# Altium schematic sheet POWER.SchDoc: POWER
size A4; Date: *******; ApprovedBy: *******; Author: *******; CompanyName: *******; Engineer: *******; Organization: *******; Address1: *******; Address2: *******; Address3: *******; Address4: *******; DocumentNumber: 2; Revision: *******; SheetNumber: 2; SheetTotal: 4; CurrentTime: *******; CurrentDate: *******; Time: *******; DocumentFullPathAndName: *******; DocumentName: *******; ModifiedDate: *******; ImagePath: *******; ProjectName: *******; Application_BuildNumber: *******
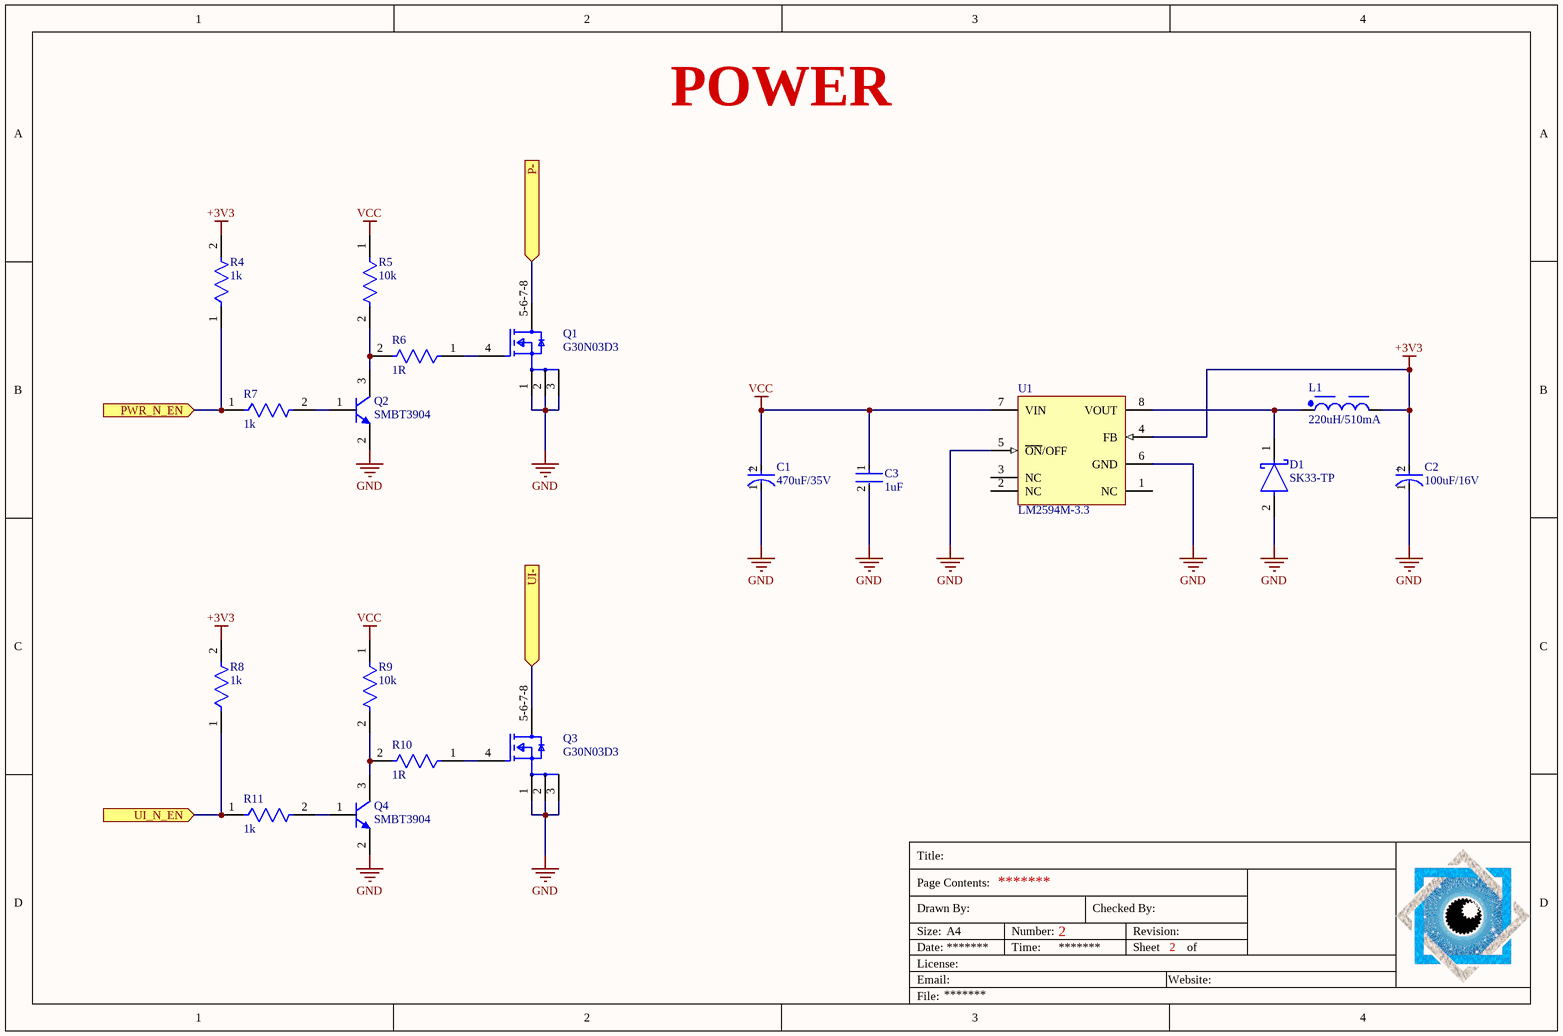
[diagram p0: POWER.SchDoc]

## Parts
C1  470uF/35V  [FP-FKSG-MFG]
C2  100uF/16V  [FP-TAJC-MFG]
C3  1uF  [FP-0603-L_1_6_0_15-W_0_8-IPC_C]
D1  SK33-TP  [FP-SMC-MFG]
L1  220uH/510mA  [WE-PD2_7850]
Q1  G30N03D3  [FP-511AB-MFG]
Q2  SMBT3904  [INF-SOT23_L]
Q3  G30N03D3  [FP-511AB-MFG]
Q4  SMBT3904  [INF-SOT23_L]
R4  1k  [FP-RP731J-MFG]
R5  10k  [FP-RP731J-MFG]
R6  1R  [FP-RP731J-MFG]
R7  1k  [FP-RP731J-MFG]
R8  1k  [FP-RP731J-MFG]
R9  10k  [FP-RP731J-MFG]
R10  1R  [FP-RP731J-MFG]
R11  1k  [FP-RP731J-MFG]
U1  LM2594M-3.3  [D0008A_M]

## Ports
P- (in, see CONNECTORS[1B]), PWR_N_EN (in, see MCU[2C]), UI- (in, see CONNECTORS[1B]), UI_N_EN (in, see MCU[2B])

## Nets
+3V3: C2.2(A) L1.2 R4.2 R8.2 U1.4(FB)
GND: C1.1(C) C2.1(C) C3.2 D1.2(A) Q1.1(S) Q1.2(S) Q1.3(S) Q2.2(E) Q3.1(S) Q3.2(S) Q3.3(S) Q4.2(E) U1.5(~{ON}/OFF) U1.6(GND)
VCC: C1.2(A) C3.1 R5.1 R9.1 U1.7(VIN)
P-: Q1.5-6-7-8(D) ; port P-
PWR_N_EN: R4.1 R7.1 ; port PWR_N_EN
UI-: Q3.5-6-7-8(D) ; port UI-
UI_N_EN: R8.1 R11.1 ; port UI_N_EN
NetD1_1: D1.1(C) L1.1 U1.8(VOUT)
NetQ1_4: Q1.4(G) R6.1
NetQ2_1: Q2.1(B) R7.2
NetQ2_3: Q2.3(C) R5.2 R6.2
NetQ3_4: Q3.4(G) R10.1
NetQ4_1: Q4.1(B) R11.2
NetQ4_3: Q4.3(C) R9.2 R10.2

Not connected (* = marked no-connect by the designer): U1 1(NC) 2(NC) 3(NC)

## Notes on the sheet
- Title:
- Drawn By:
- Page Contents:
- Checked By:
- Size:
- Date:
- File:
- License:
- Email:
- A4
- Number:
- Time:
- Revision:
- Sheet
- Website:
- of
- (in symbol CMP-2100-03691-2) +
- (in symbol CMP-05427-000037-1) +

## Library data of the parts
C1 = CMP-05427-000037-1: CAP ALUM 470UF 20% 35V SMD; Ripple Current: 552.5mA; Life (Hours): 2000Hour; ESR (Equivalent Series Resistance): 80mR; Ripple Current (AC): 850mA; Polarity: Polar; Max Operating Temperature: 105°C; Height - Seated (Max): 0.413inch; Height: 10.2mm; Min Operating Temperature: -55°C; Voltage Rating: 35V; Voltage Rating (DC): 35V; Package Quantity: 500; Packaging: Cut Tape; Tolerance: 20%; Capacitance: 470uF; RoHS Compliant: Yes; Mount: Surface Mount; Case/Package: Radial; Diameter: 10mm; LCSC Part #: C280413
C2 = CMP-2100-03691-2: 100uF 16V  ±10% 1Ω 2312  SMD Tantalum Capacitor; Polarity: Polar; Dissipation Factor: 8%; Leakage Current: 16uA; ESR (Equivalent Series Resistance): 1R; Width: 3.2mm; Case Code (Metric): 6032; Length: 6mm; Case Code (Imperial): 2412; Height: 2.8mm; Series: TAJ; Capacitance: 100uF; Package Quantity: 1; Height - Seated (Max): 0.11inch; Depth: 3.2mm; RoHS Compliant: Yes; Min Operating Temperature: -55°C; Mount: Surface Mount; Termination: SMD/SMT; Packaging: Tape and Reel; Max Operating Temperature: 125°C; Voltage Rating (DC): 16V; Construction: Flat; Radiation Hardening: No; Number of Pins: 2; Lead Free: Lead Free; Tolerance: 10%; Voltage Rating: 16V; Features: General Purpose; REACH SVHC: No SVHC; Case/Package: Molded; LCSC Part #: C122646
C3 = CMP-2000-07531-4: Ceramic Capacitor General Use 1uF ±10% 50V X7R 0603; Series: M; Width: 0.031inch; Mount: Surface Mount; Radiation Hardening: No; Voltage Rating (DC): 50V; Packaging: Tape and Reel; Termination: SMD/SMT; Depth: 0.8mm; Case Code (Metric): 1608; Case Code (Imperial): 0603; Height: 0.8mm; Voltage Rating: 50V; Package Quantity: 1; Halogen Free: Halogen Free; Dielectric: X7R; Min Operating Temperature: -55°C; Length: 1.6mm; Construction: Flat; Tolerance: 10%; Thickness: 0.037inch; Max Operating Temperature: 125°C; Case/Package: 0603; Capacitance: 1uF; RoHS Compliant: Yes; LCSC Part #: C478859
D1 = CMP-56206-000007-1: DIODE SCHOTTKY 30V 3A DO214AB; Max Forward Surge Current (Ifsm): 100A; Peak Reverse Current: 500uA; Element Configuration: Single; Polarity: Standard; Forward Voltage: 500mV; Capacitance: 250pF; Max Surge Current: 100A; Length: 7.11mm; Max Reverse Voltage (DC): 30V; Max Reverse Leakage Current: 500uA; Min Operating Temperature: -55°C; Case/Package: SMC; Mount: Surface Mount; Voltage Rating (DC): 30V; Width: 6.22mm; Package Quantity: 1; Packaging: Tape and Reel; Peak Non-Repetitive Surge Current: 100A; Number of Pins: 2; Current Rating: 3A; Output Current: 3A; Max Repetitive Reverse Voltage (Vrrm): 30V; Forward Current: 3A; Radiation Hardening: No; Height: 2.417mm; Lead Free: Lead Free; Average Rectified Current: 3A; Max Operating Temperature: 150°C; LCSC Part #: C151786
L1 = CMP-0227-00452-2: NexarPartId: 22803417; Current Rating: 510mA; DC Resistance (DCR): 614mΩ; Self Resonant Frequency: 5MHz; Inductance: 220µH; Inductance Tolerance: 10%; Length: 7mm; Resistance: 614mΩ; Height: 5mm; Min Operating Temperature: -40°C; Ambient Temperature Range High: 85°C; Ambient Temperature Range Low: -40°C; Width: 7.8mm; RoHS: Compliant; Packaging: Bulk; Number of Pins: 2; Max Operating Temperature: 125°C; LCSC Part #: C2929444
Q1 Q3 = CMP-00278-71475164-1: C840054; Manufacturer Lifecycle Status: ACTIVE; Max Power Dissipation: 3.2W; Turn-On Delay Time: 9.3ns; Turn-Off Delay Time: 17ns; Gate to Source Voltage (Vgs): 20V; Drain to Source Voltage (Vdss): 40V; Continuous Drain Current (ID): 20A; Drain to Source Resistance: 4.8mΩ; Max Junction Temperature (Tj): 175°C; Input Capacitance: 1.6nF; Rds On Max: 3.8mΩ; Number of Channels: 1; Threshold Voltage: 2V; Lead Free: Lead Free; Schedule B: 8541290080; Number of Pins: 8; Mount: Surface Mount; Power Dissipation: 3.2W; Min Operating Temperature: -55°C; RoHS: Compliant; Drain to Source Breakdown Voltage: 40V; Max Operating Temperature: 175°C; Height: 800µm; Lifecycle Status: Production; NexarPartId: 71475164; REACH SVHC: No SVHC; LCSC Part #: C840054
Q2 = CMP-1178-00005-1: NPN Silicon Switching Transistor, 40 V VCEO, 200 mA IC, SOT23, Reel, Green; Manufacturer: Infineon; VCE: 1 V; VCEO (max): 40 V; IC: 10 mA; ICBO (max): 50 nA; VCBO (max): 60 V; IC (max): 200 mA; VEBO (max): 6 V; Green: TRUE; ComponentLink3URL: http://www.infineon.com/dgdl/SOT23-Package_Overview.pdf?folderId=db3a30431936bc4b0119532290053c66&fileId=db3a30431936bc4b0119533468123c85; ComponentLink3Description: Package Specification; ComponentLink1Description: Manufacturer URL; PackageDescription: 3-Pin Small Outline Transistor Package, 1.3 x 2.9 mm Body, 0.95 mm Pitch; ComponentLink1URL: http://www.infineon.com/; PartNumber: SMBT3904; ComponentLink2URL: http://www.infineon.com/dgdl/smbt3904series_mmbt3904.pdf?folderId=db3a30431441fb5d011445fab851018e&fileId=db3a30431441fb5d0114460005c10191; Polarity: NPN; Packing: Reel; PackageReference: SOT23; ComponentLink2Description: Datasheet; PackageVersion: Apr-08; Mounting Technology: Surface Mount; VCE (max): 1 V; LCSC Part #: C896900
Q4 = CMP-1178-00005-1: C896900; Manufacturer: Infineon; VCE: 1 V; VCEO (max): 40 V; Polarity: NPN; IC: 10 mA; Packing: Reel; ICBO (max): 50 nA; VCBO (max): 60 V; IC (max): 200 mA; VEBO (max): 6 V; Green: TRUE; ComponentLink3URL: http://www.infineon.com/dgdl/SOT23-Package_Overview.pdf?folderId=db3a30431936bc4b0119532290053c66&fileId=db3a30431936bc4b0119533468123c85; ComponentLink3Description: Package Specification; ComponentLink1Description: Manufacturer URL; PackageDescription: 3-Pin Small Outline Transistor Package, 1.3 x 2.9 mm Body, 0.95 mm Pitch; ComponentLink1URL: http://www.infineon.com/; PartNumber: SMBT3904; ComponentLink2URL: http://www.infineon.com/dgdl/smbt3904series_mmbt3904.pdf?folderId=db3a30431441fb5d011445fab851018e&fileId=db3a30431441fb5d0114460005c10191; PackageReference: SOT23; ComponentLink2Description: Datasheet; PackageVersion: Apr-08; Mounting Technology: Surface Mount; VCE (max): 1 V; LCSC Part #: C896900
R4 R7 R8 R11 = CMP-03211-008596-1: Manufacturer: TE Connectivity; Manufacturer Part Number: RP73D1J8R45BTDG; Temperature Coefficient: 15ppm/°C; Resistance: 1kΩ; Voltage Rating: 75V; Value: 1kΩ; Power Rating: 0.1W; Tolerance: 0.1%; Temperature: -55°C to +105°C; octopart_url: https://octopart.com/rp73d1j8r45btdg-te+connectivity-42630912; packaging: cut tape; Device Class L2: Resistors; Series: RP73; Temperature Range High: +105°C; Package: 603; ComponentLink2Description: Datasheet; Octopart: https://octopart.com/rp73d1j8r45btdg-te+connectivity-42630912; Height: 0.55mm; Ipc Land Pattern Name: RESC15580X45; ComponentLink2URL: https://www.te.com/commerce/DocumentDelivery/DDEController?Action=srchrtrv&DocNm=1773272&DocType=DS&DocLang=English; Device Class L3: Chip SMD Resistors; Category: Res; Temperature Range Low: -55°C; RoHS: TRUE; Device Class L1: Passive Components; Composition: Thin Film; Automotive: No; Lead Free: Yes; Case/Package: 603; LCSC Part #: *
R5 R9 = CMP-03211-008596-1: Manufacturer: TE Connectivity; Manufacturer Part Number: RP73D1J8R45BTDG; Temperature Coefficient: 15ppm/°C; Resistance: 10kΩ; Voltage Rating: 75V; Value: 10kΩ; Power Rating: 0.1W; Tolerance: 0.1%; Temperature: -55°C to +105°C; octopart_url: https://octopart.com/rp73d1j8r45btdg-te+connectivity-42630912; packaging: cut tape; Device Class L2: Resistors; Series: RP73; Temperature Range High: +105°C; Package: 603; ComponentLink2Description: Datasheet; Octopart: https://octopart.com/rp73d1j8r45btdg-te+connectivity-42630912; Height: 0.55mm; Ipc Land Pattern Name: RESC15580X45; ComponentLink2URL: https://www.te.com/commerce/DocumentDelivery/DDEController?Action=srchrtrv&DocNm=1773272&DocType=DS&DocLang=English; Device Class L3: Chip SMD Resistors; Category: Res; Temperature Range Low: -55°C; RoHS: TRUE; Device Class L1: Passive Components; Composition: Thin Film; Automotive: No; Lead Free: Yes; Case/Package: 603; LCSC Part #: *
R6 R10 = CMP-03211-008596-1: Manufacturer: TE Connectivity; Manufacturer Part Number: RP73D1J8R45BTDG; Temperature Coefficient: 15ppm/°C; Resistance: 1Ω; Voltage Rating: 75V; Value: 1Ω; Power Rating: 0.1W; Tolerance: 0.1%; Temperature: -55°C to +105°C; octopart_url: https://octopart.com/rp73d1j8r45btdg-te+connectivity-42630912; packaging: cut tape; Device Class L2: Resistors; Series: RP73; Temperature Range High: +105°C; Package: 603; ComponentLink2Description: Datasheet; Octopart: https://octopart.com/rp73d1j8r45btdg-te+connectivity-42630912; Height: 0.55mm; Ipc Land Pattern Name: RESC15580X45; ComponentLink2URL: https://www.te.com/commerce/DocumentDelivery/DDEController?Action=srchrtrv&DocNm=1773272&DocType=DS&DocLang=English; Device Class L3: Chip SMD Resistors; Category: Res; Temperature Range Low: -55°C; RoHS: TRUE; Device Class L1: Passive Components; Composition: Thin Film; Automotive: No; Lead Free: Yes; Case/Package: 603; LCSC Part #: *
U1 = CMP-0069-00878-3: SIMPLE SWITCHER® Power Converter 150 KHz 0.5A Step-Down Voltage Regulator, 8-pin Narrow SOIC; Manufacturer: Texas Instruments; PackageTopMarking: NSZXTT*2594*M-3.3; PowerWise: N; RoHS: N; Code_IPC: SOIC127P600-8; Code_JEDEC: MS-012-AA; PackageDescription: SOIC Narrow, 4.9 x 3.9 x 1.45mm, 8 Lead, 1.27mm Pitch; CompType: Switcher; PackageReference: D0008A; ComponentLink1Description: Datasheet URL; PinCount: 8; ComponentLink1URL: http://www.ti.com/general/docs/lit/getliterature.tsp?genericPartNumber=LM2594&fileType=pdf; LCSC Part #: C3029048